# EAGLE design RXV2 (EAGLE 7.3.0)
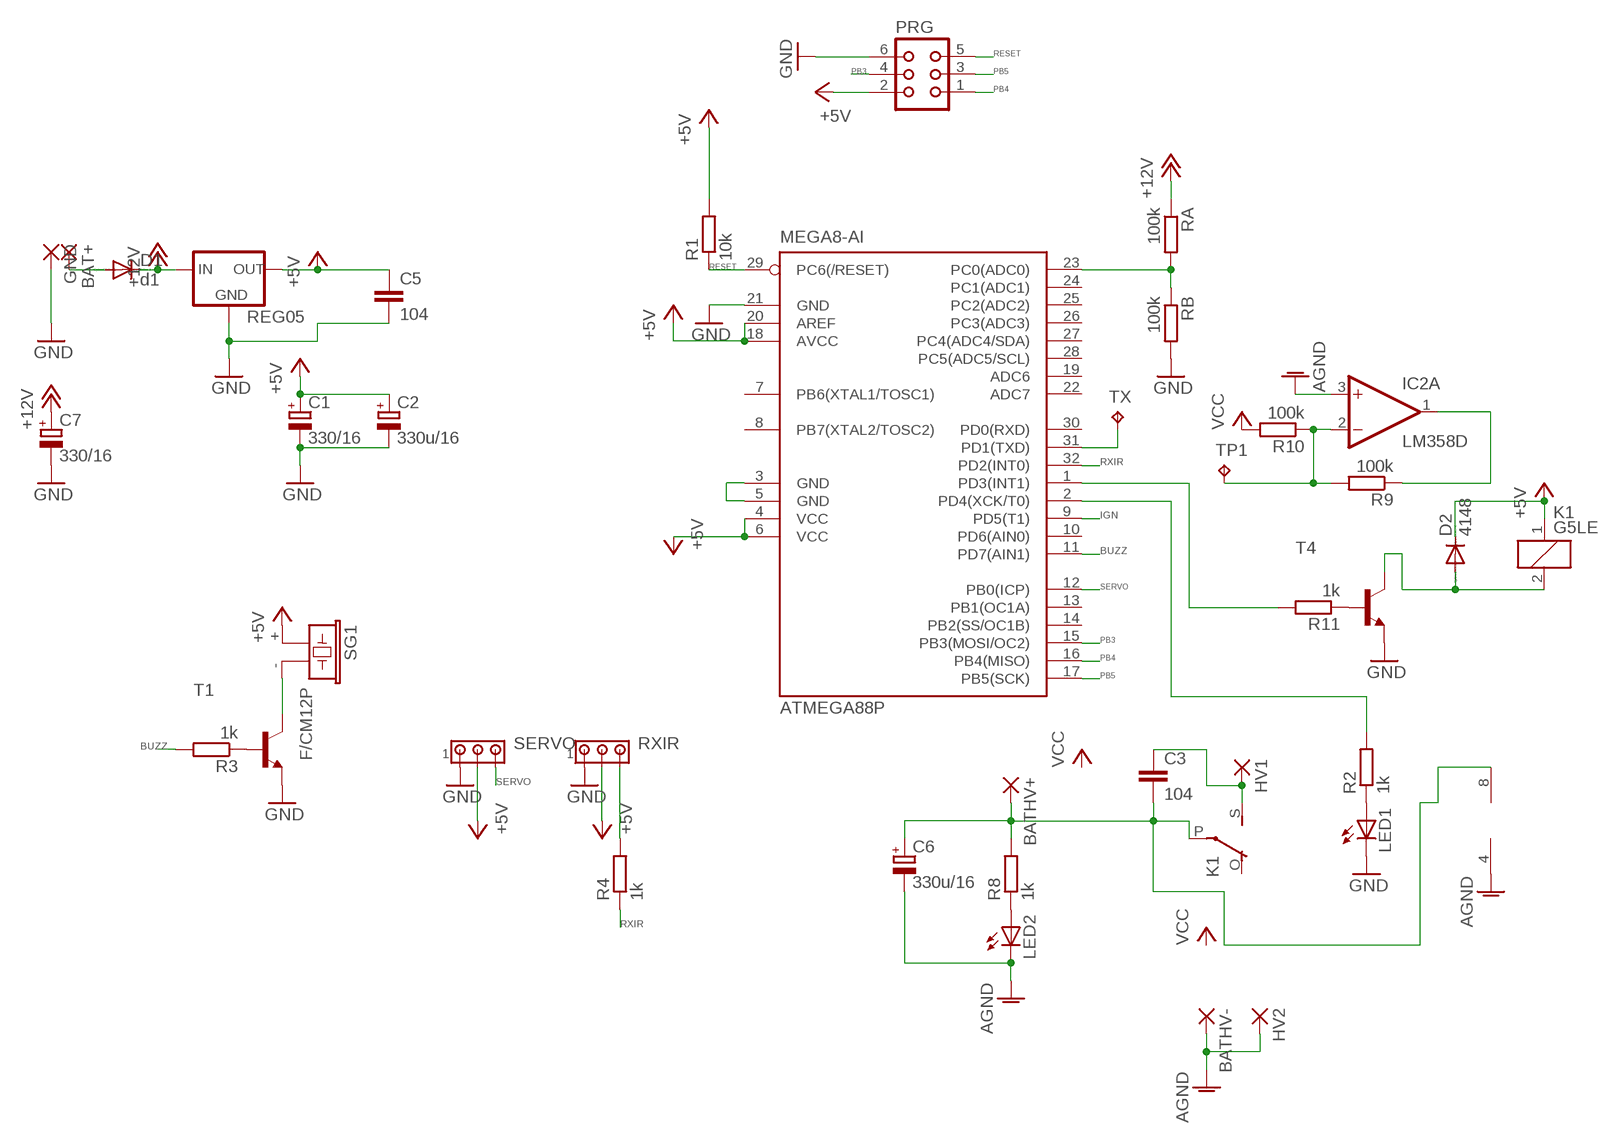
[diagram p0: schematic, sheet 1]

## Parts
ATMEGA88P  MEGA8-AI  [TQFP32-08]
BAT+  SMD5  [SMD2,54-5,08]
BATHV+  SMD5  [SMD2,54-5,08]
BATHV-  SMD5  [SMD2,54-5,08]
C1  330/16  CPOL-EUE2.5-7  [E2,5-7]
C2  330u/16  CPOL-EUE2.5-6  [E2,5-6]
C3  104  C-EUC0805  [C0805]
C5  104  C2.5/2  [C2.5-2]
C6  330u/16  CPOL-EUE2.5-6  [E2,5-6]
C7  330/16  CPOL-EUE2.5-7  [E2,5-7]
D1  d1  CGRM4007-G  [SOD-123_MINI-SMA]
D2  4148  1N4148DO35-7  [DO35-7]
GND  SMD5  [SMD2,54-5,08]
HV1  SMD5  [SMD2,54-5,08]
HV2  SMD5  [SMD2,54-5,08]
IC2  LM358D  [SO08]
K1  G5LE  [G5LE]
LED1  LEDCHIPLED_0805  [CHIPLED_0805]
LED2  LEDCHIPLED_0805  [CHIPLED_0805]
PRG  CON06  [CON06]
R1  10k  R-EU_M1206  [M1206]
R2  1k  R-EU_M1206  [M1206]
R3  1k  R-EU_M1206  [M1206]
R4  1k  R-EU_M1206  [M1206]
R8  1k  R-EU_M1206  [M1206]
R9  100k  R-EU_M1206  [M1206]
R10  100k  R-EU_M1206  [M1206]
R11  1k  R-EU_M1206  [M1206]
RA  100k  R-EU_M1206  [M1206]
RB  100k  R-EU_M1206  [M1206]
REG05  78XXS  [78XXS]
RXIR  MTA03-100  [10X03MTA]
SERVO  MTA03-100  [10X03MTA]
SG1  F/CM12P  [F/CM12P]
T1  MMBT2222ALT1-NPN-SOT23-BEC  [SOT23-BEC]
T4  MMBT2222ALT1-NPN-SOT23-BEC  [SOT23-BEC]
TP1  TPTP19R  [TP19R]
TX  TPTP19R  [TP19R]

## Nets
+5V: ATMEGA88P.4(VCC) ATMEGA88P.6(VCC) ATMEGA88P.18(AVCC) ATMEGA88P.20(AREF) C1.+ C2.+ C5.1 D2.C K1.1 PRG.2 R1.2 REG05.OUT RXIR.2 SERVO.2 SG1.+
+12V: C7.+ D1.C RA.1 REG05.IN
AGND: BATHV-.1(P) C6.- HV2.1(P) IC2.3(A:+IN) IC2.4(P:V-) LED2.C
BUZZ: ATMEGA88P.11(PD7(AIN1)) R3.2
GND: ATMEGA88P.21(GND) C1.- C2.- C5.2 C7.- GND.1(P) LED1.C PRG.6 RB.2 REG05.GND RXIR.1 SERVO.1 T1.E T4.E
IGN: ATMEGA88P.9(PD5(T1))
N$1: ATMEGA88P.3(GND) ATMEGA88P.5(GND)
N$3: BAT+.1(P) D1.A
N$4: R11.1 T4.B
N$5: SG1.- T1.C
N$6: LED1.A R2.1
N$7: R3.1 T1.B
N$8: R4.2 RXIR.3
N$10: BATHV+.1(P) C3.2 C6.+ IC2.8(P:V+) K1.P(2:P) R8.2
N$11: ATMEGA88P.31(PD1(TXD)) TX.TP
N$12: ATMEGA88P.23(PC0(ADC0)) RA.2 RB.1
N$13: ATMEGA88P.2(PD4(XCK/T0)) R2.2
N$14: LED2.A R8.1
N$15: IC2.2(A:-IN) R9.2 R10.1 TP1.TP
N$16: IC2.1(A:OUT) R9.1
N$17: ATMEGA88P.1(PD3(INT1)) R11.2
N$18: C3.1 HV1.1(P) K1.S(2:S)
N$19: D2.A K1.2 T4.C
PB3: ATMEGA88P.15(PB3(MOSI/OC2)) PRG.4
PB4: ATMEGA88P.16(PB4(MISO)) PRG.1
PB5: ATMEGA88P.17(PB5(SCK)) PRG.3
RESET: ATMEGA88P.29(PC6(/RESET)) PRG.5 R1.1
RXIR: ATMEGA88P.32(PD2(INT0)) R4.1
SERVO: ATMEGA88P.12(PB0(ICP)) SERVO.3
VCC: R10.2
Unconnected: ATMEGA88P.7(PB6(XTAL1/TOSC1)) ATMEGA88P.8(PB7(XTAL2/TOSC2)) ATMEGA88P.10(PD6(AIN0)) ATMEGA88P.13(PB1(OC1A)) ATMEGA88P.14(PB2(SS/OC1B)) ATMEGA88P.19(ADC6) ATMEGA88P.22(ADC7) ATMEGA88P.24(PC1(ADC1)) ATMEGA88P.25(PC2(ADC2)) ATMEGA88P.26(PC3(ADC3)) ATMEGA88P.27(PC4(ADC4/SDA)) ATMEGA88P.28(PC5(ADC5/SCL)) ATMEGA88P.30(PD0(RXD)) IC2.5(B:+IN) IC2.6(B:-IN) IC2.7(B:OUT) K1.O(2:O)

## Library data of the parts
ATMEGA88P = atmel:MEGA8: MICROCONTROLLER 8 Kbytes FLASH, 1 kbytes SRAM, 512 bytes EEPROM, USART, 6-channel 10 bit ADC, 2-channel 8 bit ADC Pin compatible with Atmega48, ATMega88, ATMega168 Source: avr.lbr; MPN: ATMEGA8-16AU; OC_FARNELL: 9171371; OC_NEWARK: 73M8863
BAT+ BATHV+ BATHV- GND HV1 HV2 = wirepad:SMD5: SMD PAD
C1 C2 C6 C7 = rcl:CPOL-EU: POLARIZED CAPACITOR, European symbol
C3 = rcl:C-EU: CAPACITOR, European symbol
C5 = capacitor-wima:C: CAPACITOR naming: grid - package width
D1 = diode:CGRM400*-G: Molded plasitc,JEDEC SOD-123/Mini SMA Source: Comchip CGRM4001-G.pdf
D2 = diode:1N4148: DIODE high speed (Philips)
IC2 = linear:LM358: OP AMP also LM158; LM258; LM2904 Source: http://cache.national.com/ds/LM/LM158.pdf
K1 = relay:G5LE: RELAY 1 x switch, 10 A/120 V AC, 8 A/30 V DC, Omron; OC_FARNELL: unknown; OC_NEWARK: unknown
LED1 LED2 = led:LED: LED OSRAM: - CHIPLED LG R971, LG N971, LY N971, LG Q971, LY Q971, LO R971, LY R971 LH N974, LH R974 LS Q976, LO Q976, LY Q976 LO Q996 - Hyper CHIPLED LW Q18S LB Q993, LB Q99A, LB R99A - SideLED LS A670, LO A670, LY A670, LG A670, LP A670 LB A673, LV A673, LT A673, LW A673 LH A674 LY A675 LS A676, LA A676, LO A676, LY A676, LW A676 LS A679, LY A679, LG A679 - Hyper Micro SIDELED® LS Y876, LA Y876, LO Y876, LY Y876 LT Y87S - SmartLED LW L88C, LW L88S LB L89C, LB L89S, LG L890 LS L89K, LO L89K, LY L89K LS L896, LA L896, LO L896, LY L896 - TOPLED LS T670, LO T670, LY T670, LG T670, LP T670 LSG T670, LSP T670, LSY T670, LOP T670, LYG T670 LG T671, LOG T671, LSG T671 LB T673, LV T673, LT T673, LW T673 LH T674 LS T676, LA T676, LO T676, LY T676, LB T676, LH T676, LSB T676, LW T676 LB T67C, LV T67C, LT T67C, LS T67K, LO T67K, LY T67K, LW E67C LS E67B, LA E67B, LO E67B, LY E67B, LB E67C, LV E67C, LT E67C LW T67C LS T679, LY T679, LG T679 LS T770, LO T770, LY T770, LG T770, LP T770 LB T773, LV T773, LT T773, LW T773 LH T774 LS E675, LA E675, LY E675, LS T675 LS T776, LA T776, LO T776, LY T776, LB T776 LHGB T686 LT T68C, LB T68C - Hyper Mini TOPLED® LB M676 - Mini TOPLED Santana® LG M470 LS M47K, LO M47K, LY M47K Source: http://www.osram.convergy.de LUXEON: - LUMILED® LXK2-PW12-R00, LXK2-PW12-S00, LXK2-PW14-U00, LXK2-PW14-V00 LXK2-PM12-R00, LXK2-PM12-S00, LXK2-PM14-U00 LXK2-PE12-Q00, LXK2-PE12-R00, LXK2-PE12-S00, LXK2-PE14-T00, LXK2-PE14-U00 LXK2-PB12-K00, LXK2-PB12-L00, LXK2-PB12-M00, LXK2-PB14-N00, LXK2-PB14-P00, LXK2-PB14-Q00 LXK2-PR12-L00, LXK2-PR12-M00, LXK2-PR14-Q00, LXK2-PR14-R00 LXK2-PD12-Q00, LXK2-PD12-R00, LXK2-PD12-S00 LXK2-PH12-R00, LXK2-PH12-S00 LXK2-PL12-P00, LXK2-PL12-Q00, LXK2-PL12-R00 Source: www.luxeon.com KINGBRIGHT: KA-3528ASYC Source: www.kingbright.com
PRG = con-harting:CON06: CONNECTOR; OC_FARNELL: unknown; OC_NEWARK: unknown
R1-R4 R8-R11 RA RB = rcl:R-EU_: RESISTOR, European symbol
REG05 = v-reg:78XXS: VOLTAGE REGULATOR
RXIR SERVO = con-amp:MTA03-100: AMP connector
SG1 = buzzer:F/CM12P: BUZZER Source: Buerklin; OC_FARNELL: unknown; OC_NEWARK: unknown
T1 T4 = transistor-neu-to92:*-NPN-: NPN Transistror
TP1 TX = testpad:TP: Test pad

## Board
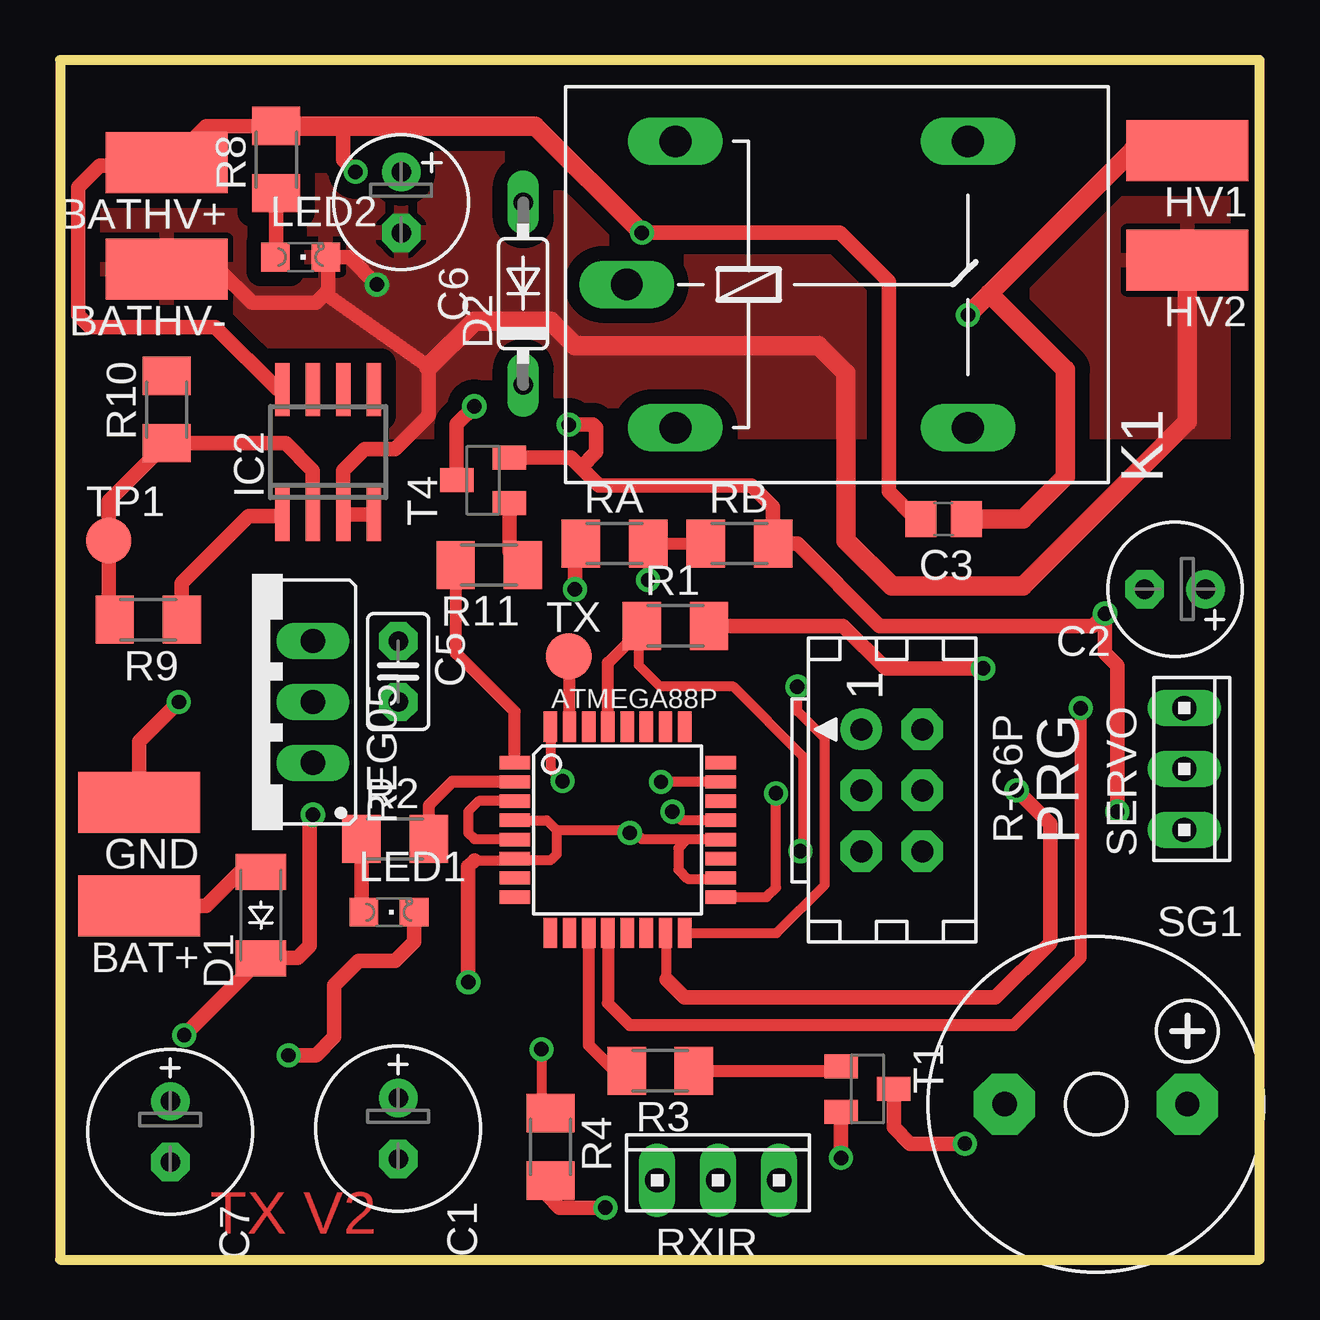
[diagram p1: board, top side]
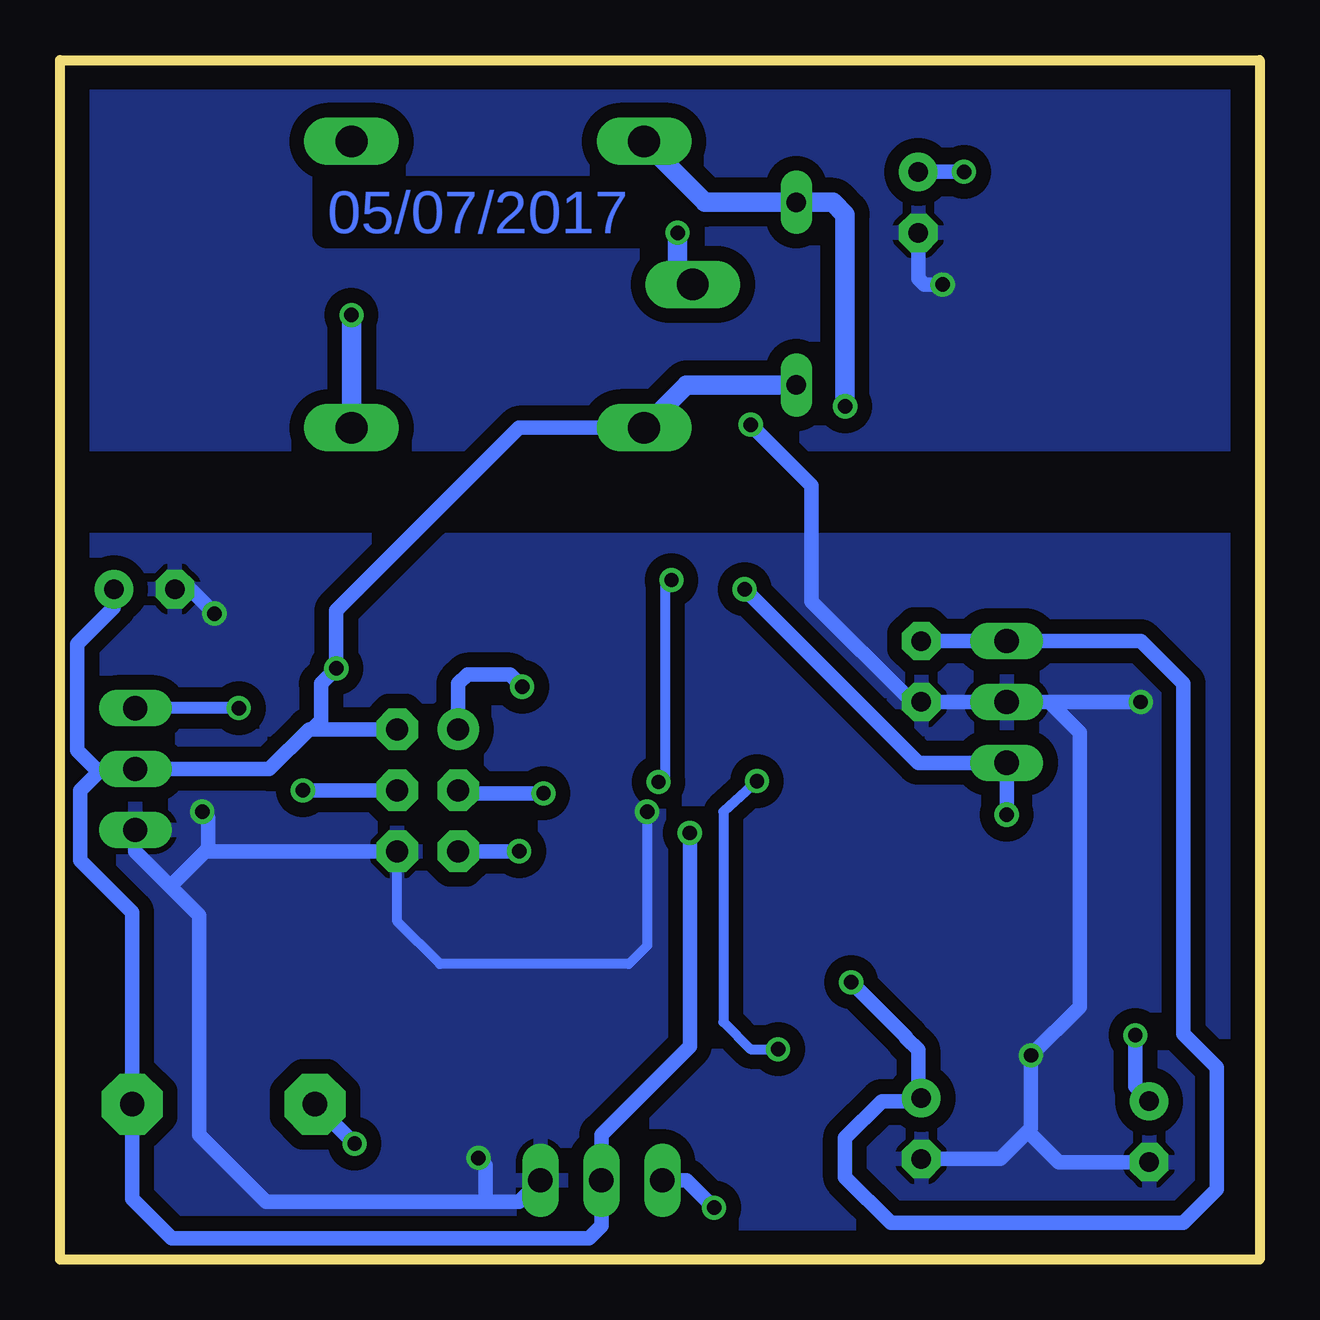
[diagram p2: board, bottom side, seen from below]

Size 50 x 50 mm. Coordinates in mm from the lower left corner, seen from the top.
Outline: 0,0 50,0 50,50 0,50 0,0
Copper layers (1*16): Top 0.035mm / dielectric 1.5mm / Bottom 0.035mm
Design rules "default": minimum track width 10mil, minimum drill 24mil, track to track 8mil, track to pad 8mil, pad to pad 8mil, via to via 8mil, smd to smd 8mil, copper to edge 40mil, drill to drill 8mil, minimum pad ring 10mil, minimum via ring 8mil, stop-mask expansion 4mil, vias tented up to drill 0mil, thermal gap 10mil

### Footprints (pad centres in the part's own frame; a part is rotated, then mirrored left to right if it is on the bottom)
TQFP32-08 = smd 1.27 x 0.559: 1 -4.293,2.8; 2 -4.293,2; 3 -4.293,1.2; 4 -4.293,0.4; 5 -4.293,-0.4; 6 -4.293,-1.2; 7 -4.293,-2; 8 -4.293,-2.8; 17 4.293,-2.8; 18 4.293,-2; 19 4.293,-1.2; 20 4.293,-0.4; 21 4.293,0.4; 22 4.293,1.2; 23 4.293,2; 24 4.293,2.8 | smd 0.559 x 1.27: 9 -2.8,-4.293; 10 -2,-4.293; 11 -1.2,-4.293; 12 -0.4,-4.293; 13 0.4,-4.293; 14 1.2,-4.293; 15 2,-4.293; 16 2.8,-4.293; 25 2.8,4.293; 26 2,4.293; 27 1.2,4.293; 28 0.4,4.293; 29 -0.4,4.293; 30 -1.2,4.293; 31 -2,4.293; 32 -2.8,4.293
SMD2,54-5,08 = smd 2.54 x 5.08: 1 0,0
E2,5-7 = drill 0.813 pad 1.6: + -1.27,0 | drill 0.813 pad 1.6 octagon: - 1.27,0
E2,5-6 = drill 0.813 pad 1.6: + -1.27,0 | drill 0.813 pad 1.6 octagon: - 1.27,0
C0805 = smd 1.3 x 1.5: 1 -0.95,0; 2 0.95,0
C2.5-2 = drill 0.813 pad 1.6 octagon: 1 -1.27,0; 2 1.27,0
SOD-123_MINI-SMA = smd 1.5 x 2.1: A 1.8,0; C -1.8,0
DO35-7 = drill 0.813 long: A 3.81,0; C -3.81,0
SO08 = smd 0.6 x 2.2: 1 -1.905,-2.6; 2 -0.635,-2.6; 3 0.635,-2.6; 4 1.905,-2.6; 5 1.905,2.6; 6 0.635,2.6; 7 -0.635,2.6; 8 -1.905,2.6
G5LE = drill 1.321 long: 1 -7.493,-5.969; 2 -7.493,5.969; O 4.699,5.969; P -9.525,0; S 4.699,-5.969
CHIPLED_0805 = smd 1.2 x 1.2: A 0,-1.05; C 0,1.05
CON06 = drill 0.914 pad 1.727: 1 -2.54,-1.27 | drill 0.914 pad 1.727 octagon: 2 -2.54,1.27; 3 0,-1.27; 4 0,1.27; 5 2.54,-1.27; 6 2.54,1.27
M1206 = smd 1.6 x 2: 1 -1.4,0; 2 1.4,0
78XXS = drill 1.016 long: GND 0,-2.54; IN -2.54,-2.54; OUT 2.54,-2.54
10X03MTA = drill 1.016 long: 1 2.54,0; 2 0,0; 3 -2.54,0
F/CM12P = drill 1.016 pad 2.54 octagon: + 3.81,0; - -3.81,0
SOT23-BEC = smd 1 x 1.4: B -0.95,-1.1; C 0,1.1; E 0.95,-1.1
TP19R = smd 1.9 x 1.9: TP 0,0

### Placement (x,y rotation side)
ATMEGA88P  23.24,17.91 0 top
BAT+  3.3,14.73 90 top
BATHV+  4.45,45.72 90 top
BATHV-  4.45,41.27 90 top
C1  14.1,5.46 270 top
C2  46.48,27.94 180 top
C3  36.83,30.86 180 top
C5  14.1,24.51 270 top
C6  14.22,44.07 270 top
C7  4.6,5.33 270 top
D1  8.38,14.35 90 top
D2  19.3,40.26 90 top
GND  3.3,19.05 90 top
HV1  46.99,46.23 90 top
HV2  46.99,41.66 90 top
IC2  11.18,33.66 0 top
K1  33.15,40.64 0 top
LED1  13.72,14.48 270 top
LED2  10.03,41.78 270 top
PRG  34.67,19.56 270 top
R1  25.65,26.42 0 top
R2  13.97,17.53 0 top
R3  25.02,7.87 180 top
R4  20.45,4.7 270 top
R8  9.02,45.85 90 top
R9  3.68,26.67 180 top
R10  4.45,35.43 90 top
R11  17.89,28.95 180 top
RA  23.11,29.84 0 top
RB  28.32,29.84 0 top
REG05  8,23.24 90 top
RXIR  27.43,3.3 0 top
SERVO  46.86,20.45 270 top
SG1  43.18,6.48 0 top
T1  33.66,7.11 270 top
T4  17.64,32.48 90 top
TP1  2.03,29.97 0 top
TX  21.21,25.15 0 top

### Tracks (layer width: path | path; a pad name or v marks a point on that pad's centre or on a via)
+5V  (via drill 0.6)
  Top 0.406: 17.27,16.64 18.88,16.64 ATMEGA88P.6 19.02,16.64 20.45,16.64 20.7,16.89 20.7,17.91 | ATMEGA88P.4 20.3,18.31 20.7,17.91 | 20.7,17.91 23.88,17.91 | 23.88,17.91 24.26,17.53 27.52,17.53 ATMEGA88P.20 26.14,17.51 25.78,17.14 25.78,16.26 26.16,15.88 27.5,15.88 ATMEGA88P.18 | 23.88,17.91 v23.75,17.78
  Top 0.61: v17.02,11.56 17.02,16.38 17.27,16.64 | R1.2 32.64,26.42 34.42,24.64 v38.48,24.64
  Bottom 0.61: 48.39,20.32 49.15,19.56 49.15,16.64 46.99,14.48 SG1.+ 46.99,2.54 45.34,0.89 27.94,0.89 27.43,1.4 RXIR.2 27.43,5.21 23.75,8.89 v23.75,17.78 | 48.39,20.32 48.26,20.45 SERVO.2 41.27,20.45 39.62,22.1 39.5,22.1 | PRG.2 39.5,22.1 | v17.02,11.56 14.73,9.27 14.73,9.25 14.22,8.74 14.22,6.86 C1.+ 14.22,6.6 15.75,6.6 17.27,5.08 17.27,3.43 15.37,1.52 3.17,1.52 1.78,2.92 1.78,8 3.17,9.4 3.17,24 4.95,25.78 C5.1 REG05.OUT | C2.+ 47.75,27.18 49.28,25.65 49.28,21.21 48.39,20.32 | 39.5,22.1 39.12,22.48 39.12,24 v38.48,24.64 38.48,27.05 30.86,34.67 K1.1
  Bottom 0.813: D2.C 23.88,36.45 K1.1
+12V  (via drill 0.6)
  Top 0.61: v5.18,9.35 D1.C 8.4,12.57 9.91,12.57 10.41,13.08 10.41,18.41 v10.54,18.54 | v21.46,27.94 21.46,29.59 RA.1
  Bottom 0.406: 4.57,6.6 4.78,6.55 C7.+
  Bottom 0.61: v10.54,18.54 REG05.IN 14.22,20.7 v21.46,27.94 | v5.18,9.35 5.18,7.21 4.57,6.6
AGND  (via drill 0.6)
  Top 0.61: BATHV-.1 6.6,41.27 8,39.88 10.67,39.88 11.05,40.26 | 11.05,40.26 11.18,40.39 11.18,41.75 LED2.C 12.06,41.78 v13.21,40.64 | 11.05,40.26 15.37,37.21 15.37,35.18 13.97,33.78 12.7,33.78 11.81,32.89 IC2.3 IC2.4
  Top 0.813: 15.37,37.21 17.27,39.12 20.45,39.12 21.46,38.1 31.62,38.1 32.77,36.96 32.77,29.97 34.67,28.07 40.13,28.07 46.99,34.92 HV2.1
  Bottom 0.61: v13.21,40.64 13.97,40.64 14.22,40.89 C6.-
  pour Top (isolate 0.61): -2.5,34.5 -2.5,52.5 52.5,52.5 52.5,34.5
  pour Bottom (isolate 0.61): -2,52 -2,34 52,34 52,52
BUZZ
  Top 0.508: R3.2 23.11,7.87 22.04,8.95 ATMEGA88P.11
GND  (via drill 0.6)
  Top 0.406: ATMEGA88P.21 25.89,18.31 v25.53,18.67
  Top 0.61: LED1.C 14.77,13.24 13.97,12.45 12.45,12.45 11.43,11.43 11.43,9.27 10.67,8.51 v9.53,8.51 | T1.E v32.55,4.23 | GND.1 3.3,21.59 v4.95,23.24 | T4.E 21.3,33.43 21.72,33.02 | 21.72,33.02 22.48,32.26 28.83,32.26 29.72,31.37 RB.2 30.73,29.84 34.16,26.42 43.05,26.42 v43.56,26.92 43.56,25.27 44.07,24.77 v44.07,18.67 | v21.21,34.8 22.23,34.8 22.35,34.67 22.35,33.66 21.72,33.02
  Bottom 0.406: v25.53,18.67 25.53,13.08 26.29,12.32 34.16,12.32 35.94,14.1 PRG.6 | 4.06,4.19 4.34,4.19 C7.-
  Bottom 0.61: SERVO.1 46.86,17.02 45.4,15.56 | 45.4,15.56 44.2,14.35 44.2,5.21 41.4,2.41 32.26,2.41 | 32.26,2.41 30.86,2.41 RXIR.1 | v32.55,4.23 32.26,3.94 32.26,2.41 | PRG.6 43.81,17.02 | 43.81,17.02 43.94,17.02 45.4,15.56 | v4.95,23.24 REG05.GND | REG05.GND 8.76,23.24 7.49,21.97 7.49,10.54 v9.53,8.51 9.53,5.46 9.65,5.33 | REG05.GND C5.2 14.48,23.24 18.67,27.43 18.67,32.26 v21.21,34.8 | 9.65,5.33 10.79,4.19 C1.- | C2.- 44.58,27.94 v43.56,26.92 | v44.07,18.67 43.81,18.41 43.81,17.02 | C7.- 8.37,4.06 9.65,5.33
  pour Bottom (isolate 0.61): -5,30 -5,0 50,0 50,30
N$1
  Top 0.406: ATMEGA88P.3 17.46,19.11 17.02,18.67 17.02,17.78 17.27,17.53 18.93,17.53 ATMEGA88P.5
N$3
  Top 0.61: D1.A 7.51,16.15 6.1,14.73 BAT+.1
N$4
  Top 0.61: T4.B 18.74,29.5 R11.1
N$5  (via drill 0.6)
  Top 0.61: T1.C 34.76,5.5 35.43,4.83 v37.72,4.83
  Bottom 0.61: v37.72,4.83 SG1.-
N$6
  Top 0.61: R2.1 12.57,14.51 LED1.A
N$7
  Top 0.508: R3.1 32.37,7.87 T1.B
N$8  (via drill 0.6)
  Top 0.61: v22.73,2.16 20.83,2.16 20.32,2.67 20.32,3.17 R4.2
  Bottom 0.61: RXIR.3 23.88,3.3 v22.73,2.16
N$10  (via drill 0.6)
  Top 0.61: R8.2 10.28,47.24 6.1,47.24 4.57,45.72 BATHV+.1 4.32,45.59 1.65,45.59 0.76,44.7 0.76,39.37 1.27,38.86 6.48,38.86 9.08,36.26 IC2.8 | C3.2 35.69,30.86 34.54,32 34.54,40.77 32.51,42.8 v24.26,42.8 | v12.32,45.34 11.81,45.85 11.81,47.12 11.94,47.25
  Top 0.813: R8.2 11.94,47.25 19.81,47.25 v24.26,42.8
  Bottom 0.61: C6.+ v12.32,45.34
  Bottom 0.813: v24.26,42.8 24.26,41.27 K1.P
N$11
  Top 0.508: TX.TP 21.21,22.23 ATMEGA88P.31
N$12  (via drill 0.6)
  Top 0.406: ATMEGA88P.23 v25.05,19.91 | v24.51,28.32 RA.2
  Top 0.508: RA.2 RB.1
  Bottom 0.406: v25.05,19.91 24.77,20.19 24.77,28.07 v24.51,28.32
N$13
  Top 0.508: ATMEGA88P.2 16.35,19.91 15.37,18.92 R2.2
N$14
  Top 0.61: R8.1 9.02,41.88 LED2.A
N$15
  Top 0.61: IC2.2 10.54,32.89 9.4,34.03 R10.1 2.03,31.62 TP1.TP 2.03,26.92 R9.2
N$16
  Top 0.61: R9.1 5.08,28.2 7.87,30.99 9.2,30.99 IC2.1
N$17
  Top 0.508: ATMEGA88P.1 18.95,22.84 16.51,25.27 16.51,28.93 R11.2
N$18  (via drill 0.6)
  Top 0.813: HV1.1 44.7,46.23 38.73,40.26 | 38.73,40.26 v37.85,39.37 | C3.1 40.13,30.86 41.91,32.64 41.91,37.08 38.73,40.26
  Bottom 0.813: v37.85,39.37 K1.S
N$19  (via drill 0.6)
  Top 0.61: T4.C 16.54,34.83 v17.27,35.56
  Bottom 0.813: K1.2 23.11,44.07 D2.A 17.78,44.07 17.27,43.56 v17.27,35.56
PB3  (via drill 0.6)
  Top 0.406: 25.27,11.68 25.27,13.58 ATMEGA88P.15
  Top 0.61: v39.88,19.56 41.27,18.16 41.27,13.21 38.99,10.92 26.04,10.92 25.27,11.68
  Bottom 0.61: PRG.4 v39.88,19.56
PB4  (via drill 0.6)
  Top 0.406: ATMEGA88P.16 29.87,13.61 31.88,15.62 31.88,21.72 30.73,22.86 v30.73,23.88
  Bottom 0.61: v30.73,23.88 31.24,24.38 33.02,24.38 33.4,24 PRG.1
PB5  (via drill 0.6)
  Top 0.406: ATMEGA88P.17 29.46,15.11 29.84,15.49 v29.84,19.43
  Bottom 0.406: 33.27,19.43 PRG.3
  Bottom 0.61: v29.84,19.43 33.27,19.43
RESET  (via drill 0.6)
  Top 0.406: v30.86,17.02 30.99,17.02 30.99,20.95 28.07,23.88 25.02,23.88 24.13,24.77 24.13,26.29 R1.1
  Top 0.508: ATMEGA88P.29 22.84,24.87 24.26,26.29 R1.1
  Bottom 0.61: PRG.5 v30.86,17.02
RXIR  (via drill 0.6)
  Top 0.406: ATMEGA88P.32 20.45,20.45 v20.95,19.95 | v20.07,8.76 20.07,6.48 R4.1
  Bottom 0.406: v20.95,19.95 22.35,18.67 22.35,9.91 21.21,8.76 v20.07,8.76
SERVO  (via drill 0.6)
  Top 0.508: ATMEGA88P.12 22.84,10.69 23.75,9.78 39.75,9.78 42.55,12.57 v42.55,22.99
  Bottom 0.508: v42.55,22.99 SERVO.3

### Text on the board
Top: TX V2
Bottom: 05/07/2017